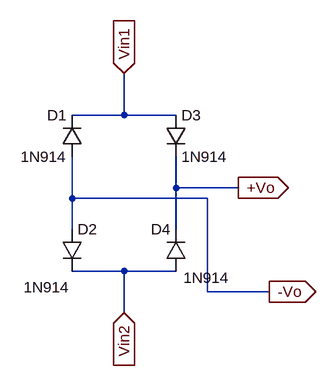
[diagram p0: schematic Puentedediodos.asc]
Puentedediodos.asc, the LTspice schematic file:
Version 4
SHEET 1 880 680
WIRE 224 48 224 -16
WIRE 224 48 144 48
WIRE 304 48 224 48
WIRE 304 160 304 112
WIRE 400 160 304 160
WIRE 144 176 144 112
WIRE 352 176 144 176
WIRE 144 224 144 176
WIRE 304 224 304 160
WIRE 224 288 144 288
WIRE 304 288 224 288
WIRE 352 320 352 176
WIRE 448 320 352 320
WIRE 224 352 224 288
FLAG 400 160 +Vo
IOPIN 400 160 Out
FLAG 448 320 -Vo
IOPIN 448 320 Out
FLAG 224 -16 Vin1
IOPIN 224 -16 In
FLAG 224 352 Vin2
IOPIN 224 352 In
SYMBOL diode 160 112 R180
WINDOW 0 24 64 Left 2
WINDOW 3 24 0 Left 2
SYMATTR InstName D1
SYMATTR Value 1N914
SYMBOL diode 128 224 R0
WINDOW 3 -59 89 Left 2
SYMATTR Value 1N914
SYMATTR InstName D2
SYMBOL diode 288 48 R0
SYMATTR InstName D3
SYMATTR Value 1N914
SYMBOL diode 320 288 R180
WINDOW 0 24 64 Left 2
WINDOW 3 -67 -10 Left 2
SYMATTR InstName D4
SYMATTR Value 1N914

The netlist it stands for:
* Puentedediodos.asc
D1 -Vo Vin1 1N914
D2 -Vo Vin2 1N914
D3 Vin1 +Vo 1N914
D4 Vin2 +Vo 1N914
.model D D
.lib standard.dio
.backanno
.end